# EAGLE design BUZZI-02 (EAGLE 4.15)
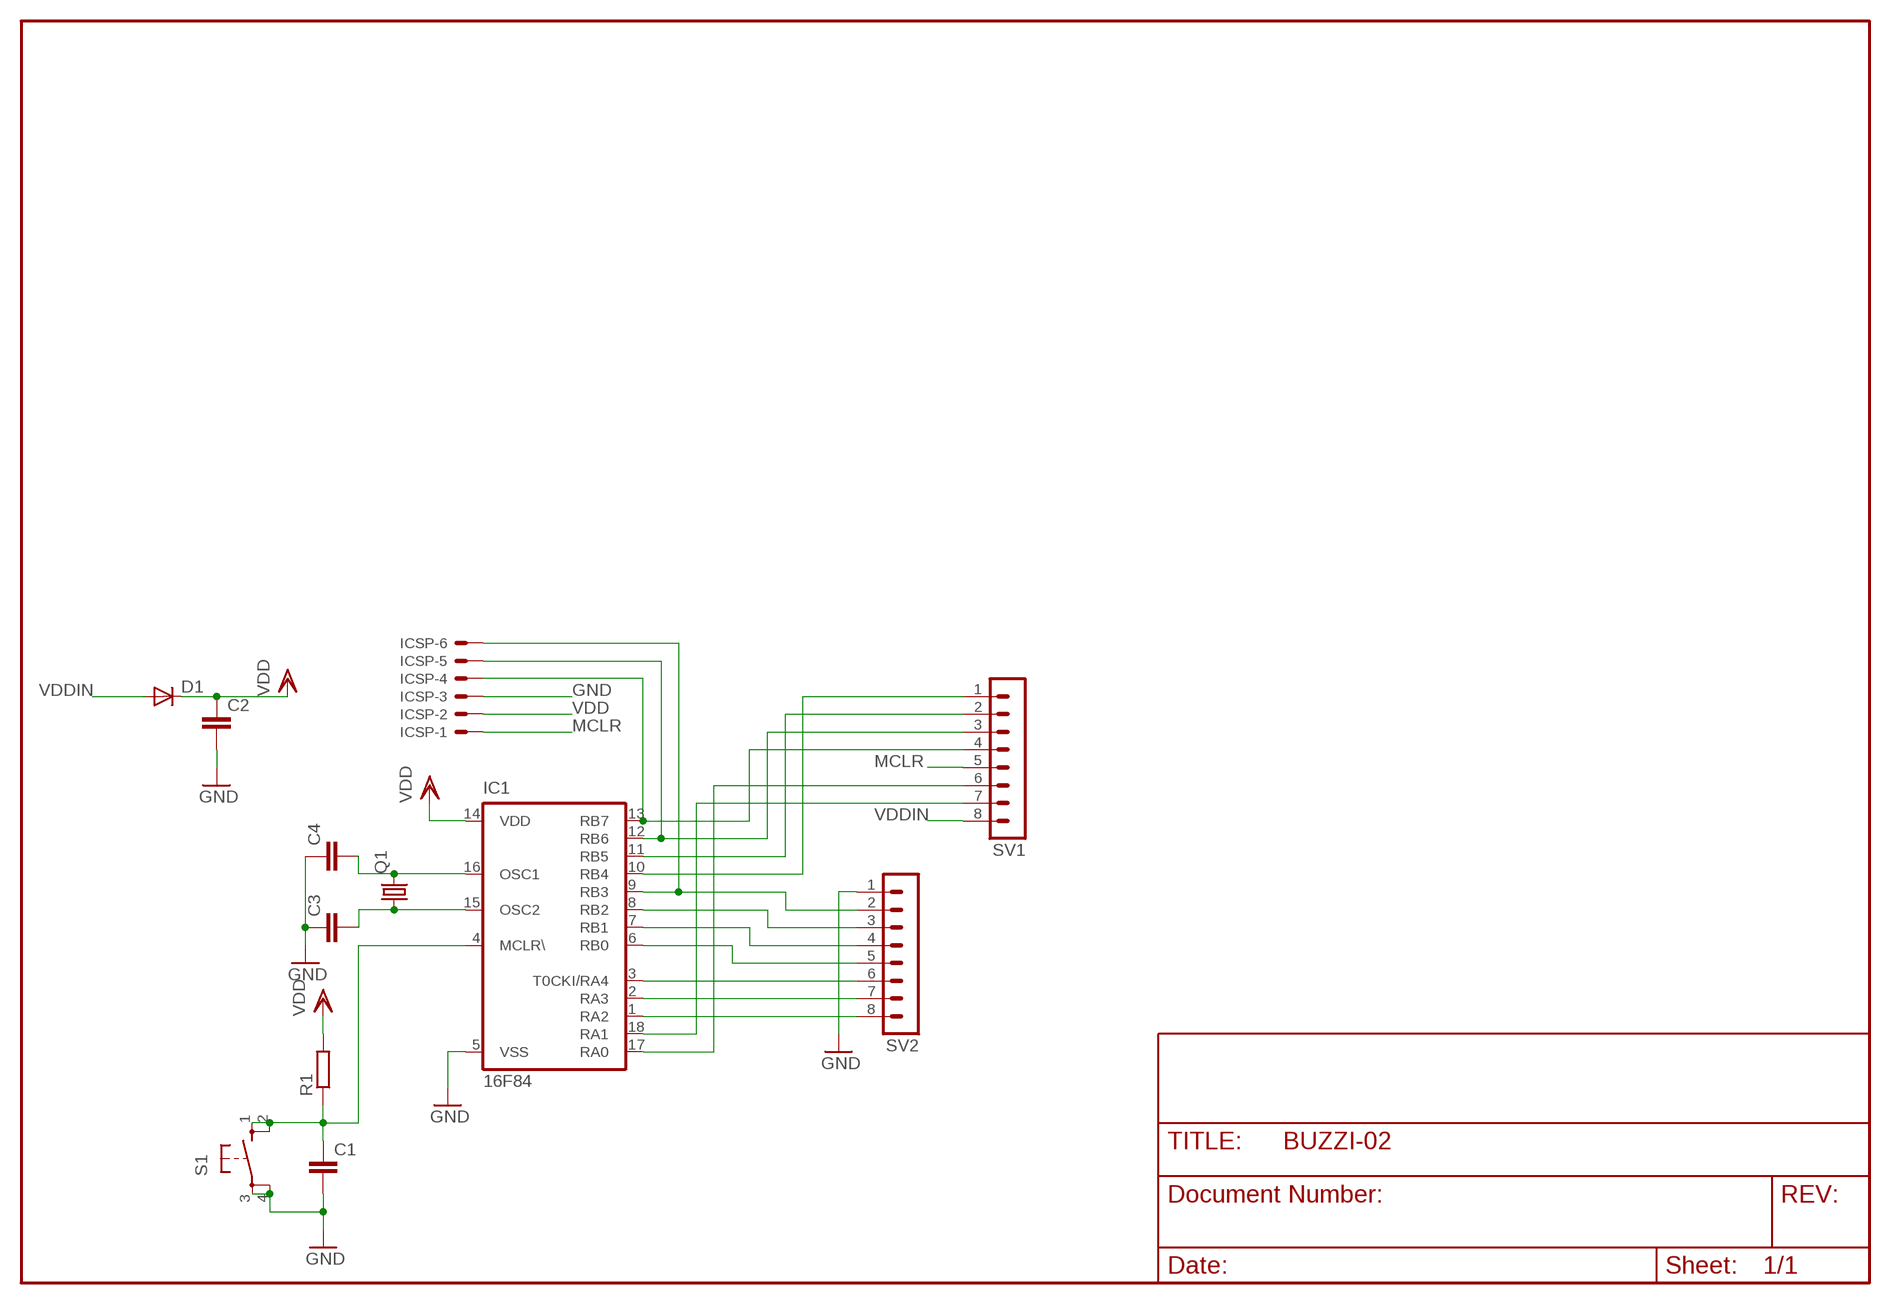
[diagram p0: schematic, sheet 1]

## Parts
C1  C-EUC0805  [C0805]
C2  C-EUC0805  [C0805]
C3  C-EUC0805  [C0805]
C4  C-EUC0805  [C0805]
D1  DIODE-SOD80C  [SOD80C]
IC1  16F84  PIC16F84ASO  [SO-18W]
ICSP  53047-06  [53047-06]
Q1  CRYTALHC49U-V  [HC49U-V]
R1  R-EU_M0805  [M0805]
S1  10XX  [B3F-10XX]
SV1  MA08-1  [MA08-1]
SV2  MA08-1  [MA08-1]

## Nets
GND: C1.2 C2.2 C3.1 C4.1 IC1.5(VSS) ICSP.3 S1.3 S1.4 SV2.1
MCLR: C1.1 IC1.4(MCLR\) ICSP.1 R1.1 S1.1 S1.2 SV1.5
N$1: C4.2 IC1.16(OSC1) Q1.2
N$2: C3.2 IC1.15(OSC2) Q1.1
N$3: IC1.6(RB0) SV2.5
N$4: IC1.7(RB1) SV2.4
N$5: IC1.8(RB2) SV2.3
N$6: IC1.9(RB3) ICSP.6 SV2.2
N$7: IC1.13(RB7) ICSP.4 SV1.4
N$8: IC1.1(RA2) SV2.8
N$9: IC1.2(RA3) SV2.7
N$10: IC1.3(T0CKI/RA4) SV2.6
N$11: IC1.12(RB6) ICSP.5 SV1.3
N$12: IC1.11(RB5) SV1.2
N$13: IC1.10(RB4) SV1.1
N$14: IC1.17(RA0) SV1.6
N$15: IC1.18(RA1) SV1.7
VDD: C2.1 D1.C IC1.14(VDD) ICSP.2 R1.2
VDDIN: D1.A SV1.8

## Library data of the parts
C1-C4 = rcl:C-EU: CAPACITOR, European symbol
D1 = diode:DIODE-: DIODE
IC1 = microchip:PIC16F8*: MICROCONTROLLER 8-Bit PIC16F8X Family - CMOS Flash/EEPROM Pin Compatible : PIC16F83, PIC16CR83, PIC16F84A, PIC16CR84 see also PIC16C*
ICSP = con-molex:53?-06: CONNECTOR wire to board 1.25 mm (.049 inch) pitch header
Q1 = crystal:CRYTAL: CRYSTAL
R1 = rcl:R-EU_: RESISTOR, European symbol
S1 = KEY_B:10XX
SV1 SV2 = con-lstb:MA08-1: PIN HEADER

## Board
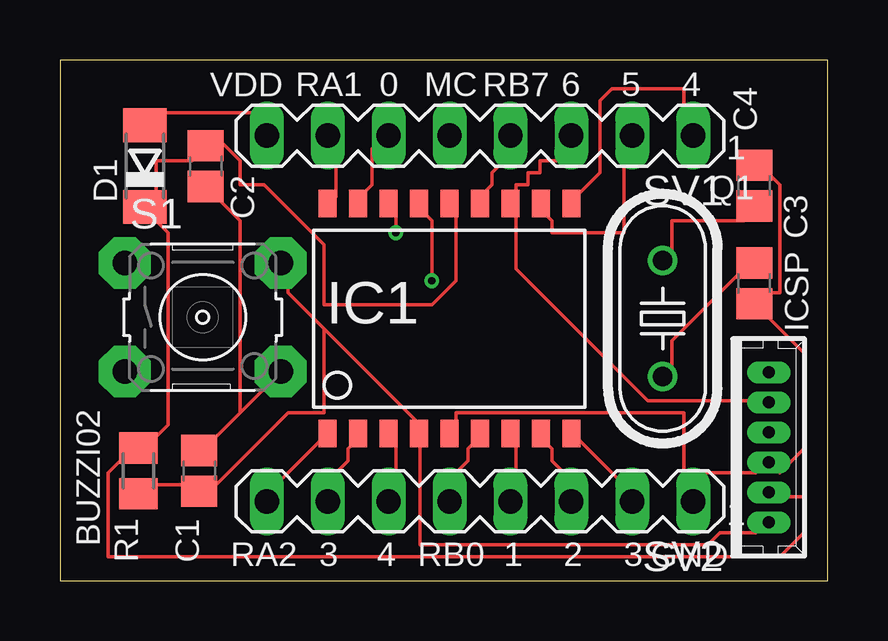
[diagram p1: board, top side]
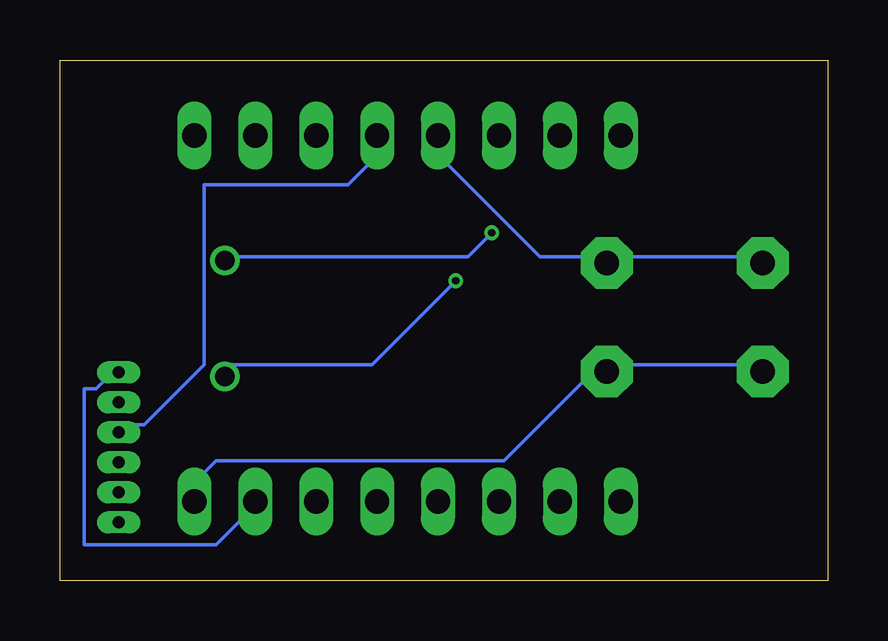
[diagram p2: board, bottom side, seen from below]

Size 32 x 21.7 mm. Coordinates in mm from the lower left corner, seen from the top.
Outline: 0,0 32,0 32,21.7 0,21.7 0,0
Copper layers (1*16): Top 0.035mm / dielectric 1.5mm / Bottom 0.035mm
Design rules "PCB-POOL": minimum track width 6mil, minimum drill 12mil, track to track 6mil, track to pad 6mil, pad to pad 6mil, via to via 6mil, smd to smd 6mil, copper to edge 20mil, drill to drill 8mil, minimum pad ring 8mil, minimum via ring 6mil, stop-mask expansion 3mil, vias tented up to drill 0mil, thermal gap 8mil

### Footprints (pad centres in the part's own frame; a part is rotated, then mirrored left to right if it is on the bottom)
C0805 = smd 1.3 x 1.5: 1 -0.85,0; 2 0.85,0
SOD80C = smd 1.4 x 1.8: A 1.7,0; C -1.7,0
SO-18W = smd 0.762 x 1.143: 1 -5.08,-4.788; 2 -3.81,-4.788; 3 -2.54,-4.788; 4 -1.27,-4.788; 5 0,-4.788; 6 1.27,-4.788; 7 2.54,-4.788; 8 3.81,-4.788; 9 5.08,-4.788; 10 5.08,4.788; 11 3.81,4.788; 12 2.54,4.788; 13 1.27,4.788; 14 0,4.788; 15 -1.27,4.788; 16 -2.54,4.788; 17 -3.81,4.788; 18 -5.08,4.788
53047-06 = drill 0.5 pad 0.698 long: 1 3.125,0; 2 1.875,0; 3 0.625,0; 4 -0.625,0; 5 -1.875,0; 6 -3.125,0
HC49U-V = drill 0.813 round: 1 -2.413,0; 2 2.413,0
M0805 = smd 1.3 x 1.6: 1 -0.95,0; 2 0.95,0
B3F-10XX = drill 1.016 pad 2.159 octagon: 1 -3.379,2.312; 2 3.123,2.312; 3 -3.379,-2.209; 4 3.123,-2.209
MA08-1 = drill 1.016 long: 1 -8.89,0; 2 -6.35,0; 3 -3.81,0; 4 -1.27,0; 5 1.27,0; 6 3.81,0; 7 6.35,0; 8 8.89,0

### Placement (x,y rotation side)
C1  5.81,4.58 90 top
C2  6.08,17.28 270 top
C3  28.94,12.39 90 top
C4  28.94,16.47 270 top
D1  3.54,17.28 90 top
IC1  16.24,10.93 0 top
ICSP  29.55,5.56 270 top
Q1  25.13,10.93 90 top
R1  3.27,4.58 90 top
S1  6.08,10.93 0 top
SV1  17.51,18.55 180 top
SV2  17.51,3.31 180 top

### Tracks (layer width: path | path; a pad name or v marks a point on that pad's centre or on a via)
GND
  Top 0.152: 7.5,7 8.5,8 S1.4 | 7.5,7 6.5,6 C1.2 | 7.5,7 7.5,15 6.5,16 C2.2 | C4.1 29.5,17 30,16.5 30,12 29.5,12 C3.1 29.5,11 31,9.5 31,5.5 30,4.5 ICSP.3 29,4.5 26.5,4.5 SV2.1 26,4.5 26,7 16.5,7 16.5,6.5 IC1.5
  Bottom 0.152: S1.3 3.5,9 8.5,9 S1.4 10,8.5 13.5,5 25.5,5 26,4.5 SV2.1
MCLR
  Top 0.152: R1.1 4,4 5.5,4 C1.1 6.5,4 9.5,7 11,7 11,10.5 | 11,10.5 9.5,12 9.5,12.5 S1.2 | 11,10.5 15,6.5 IC1.4 15,6 15,1.5 27,1.5 27.5,2 29,2 ICSP.1
  Bottom 0.152: SV1.5 16,17.5 12,13.5 10,13.5 S1.2 8.5,13.5 3.5,13.5 S1.1
N$1  (via drill 0.3)
  Top 0.152: v14,14.5 14,15.5 IC1.16 | C4.2 28.5,15 25.5,15 25.5,13.5 Q1.2
  Bottom 0.152: v14,14.5 15,13.5 25,13.5 Q1.2
N$2  (via drill 0.3)
  Top 0.152: v15.5,12.5 15.5,15 15,15.5 IC1.15 | C3.2 28.5,13 25.5,10 25.5,9 Q1.1
  Bottom 0.152: v15.5,12.5 19,9 25,9 Q1.1
N$3
  Top 0.152: IC1.6 17.5,6 17,5.5 17,5 16.5,4.5 SV2.5
N$4
  Top 0.152: IC1.7 19,6 19,4.5 SV2.4
N$5
  Top 0.152: IC1.8 20,6 20.5,5.5 20.5,5 21,4.5 SV2.3
N$6
  Top 0.152: IC1.9 21.5,6 23.5,4 SV2.2
  Bottom 0.152: ICSP.6 30,8.5 30.5,8 31,8 31,1.5 25.5,1.5 24.5,2.5 SV2.2
N$7
  Top 0.152: IC1.13 17.5,16 18,16.5 18,17 18.5,17.5 SV1.4
  Bottom 0.152: ICSP.4 29,6.5 28.5,6.5 26,9 26,16.5 20,16.5 19,17.5 SV1.4
N$8
  Top 0.152: IC1.1 11,6 9,4 SV2.8
N$9
  Top 0.152: IC1.2 12.5,6 12,5.5 12,5 11.5,4.5 SV2.7
N$10
  Top 0.152: IC1.3 14,6 14,4.5 SV2.6
N$11
  Top 0.152: ICSP.5 29,7.5 24.5,7.5 19,13 19,15.5 IC1.12 19,16 19,16.5 19.5,16.5 19.5,17 20,17 20,17.5 21,17.5 SV1.3
N$12
  Top 0.152: IC1.11 20,15.5 20.5,15 20.5,14.5 23.5,14.5 23.5,17.5 SV1.2
N$13
  Top 0.152: IC1.10 21.5,16 22.5,17 22.5,20 23,20.5 26,20.5 26,19.5 SV1.1
N$14
  Top 0.152: IC1.17 12.5,16 13,16.5 13,18 SV1.6
N$15
  Top 0.152: IC1.18 11.5,16 11.5,17.5 SV1.7
VDD
  Top 0.152: IC1.14 16.5,15.5 16.5,12.5 15.5,11.5 11,11.5 11,14 8.5,16.5 7.5,16.5 7.5,17.5 6.5,18.5 C2.1 5.5,17.5 4,17.5 4,16 D1.C 4,15 4.5,14.5 4.5,6.5 4,6 R1.2 2.5,5 2,4.5 2,1 30,1 31,2 31,3.5 30,3.5 ICSP.2
VDDIN
  Top 0.152: D1.A 4,19.5 8,19.5 SV1.8

### Text on the board
tPlace: VDD | RA1 | 0 | MC | RB7 | 6 | 5 | 4 | BUZZI02 | RA2 | 3 | 4 | RB0 | 1 | 2 | 3 | GND